# Altium schematic sheet LED_String_AREM-80C0.SchDoc: STB Light Board - 850nm String
size A4; Author: flmoll; DrawnBy: flmoll; Organization: PBL; Revision: A; SheetNumber: 14; SheetTotal: 20
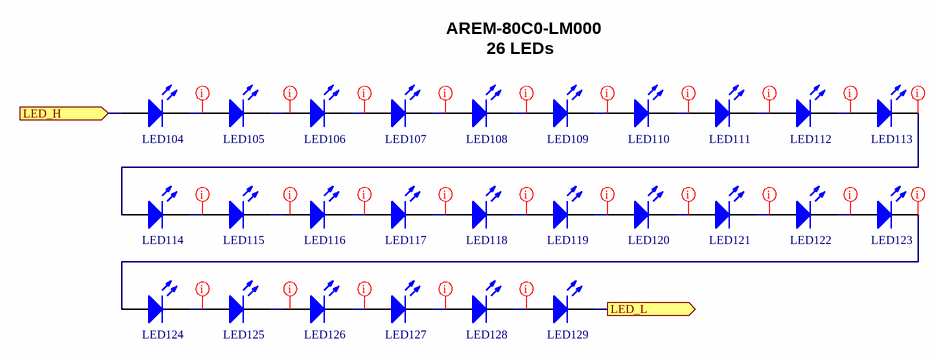
[diagram p0: LED_String_AREM-80C0.SchDoc]

## Parts
LED104  AREM-80C0-LM000  [AREM-80C0-LM000]  (value not drawn)
LED105  AREM-80C0-LM000  [AREM-80C0-LM000]  (value not drawn)
LED106  AREM-80C0-LM000  [AREM-80C0-LM000]  (value not drawn)
LED107  AREM-80C0-LM000  [AREM-80C0-LM000]  (value not drawn)
LED108  AREM-80C0-LM000  [AREM-80C0-LM000]  (value not drawn)
LED109  AREM-80C0-LM000  [AREM-80C0-LM000]  (value not drawn)
LED110  AREM-80C0-LM000  [AREM-80C0-LM000]  (value not drawn)
LED111  AREM-80C0-LM000  [AREM-80C0-LM000]  (value not drawn)
LED112  AREM-80C0-LM000  [AREM-80C0-LM000]  (value not drawn)
LED113  AREM-80C0-LM000  [AREM-80C0-LM000]  (value not drawn)
LED114  AREM-80C0-LM000  [AREM-80C0-LM000]  (value not drawn)
LED115  AREM-80C0-LM000  [AREM-80C0-LM000]  (value not drawn)
LED116  AREM-80C0-LM000  [AREM-80C0-LM000]  (value not drawn)
LED117  AREM-80C0-LM000  [AREM-80C0-LM000]  (value not drawn)
LED118  AREM-80C0-LM000  [AREM-80C0-LM000]  (value not drawn)
LED119  AREM-80C0-LM000  [AREM-80C0-LM000]  (value not drawn)
LED120  AREM-80C0-LM000  [AREM-80C0-LM000]  (value not drawn)
LED121  AREM-80C0-LM000  [AREM-80C0-LM000]  (value not drawn)
LED122  AREM-80C0-LM000  [AREM-80C0-LM000]  (value not drawn)
LED123  AREM-80C0-LM000  [AREM-80C0-LM000]  (value not drawn)
LED124  AREM-80C0-LM000  [AREM-80C0-LM000]  (value not drawn)
LED125  AREM-80C0-LM000  [AREM-80C0-LM000]  (value not drawn)
LED126  AREM-80C0-LM000  [AREM-80C0-LM000]  (value not drawn)
LED127  AREM-80C0-LM000  [AREM-80C0-LM000]  (value not drawn)
LED128  AREM-80C0-LM000  [AREM-80C0-LM000]  (value not drawn)
LED129  AREM-80C0-LM000  [AREM-80C0-LM000]  (value not drawn)

## Ports
LED_H (in, see LED_Driver_AREM-80C0[2B]), LED_L (out, see LED_Driver_AREM-80C0[2B])

## Nets
LED_H: LED104.2(A) ; port LED_H
LED_L: LED129.1(K) ; port LED_L
NetLED104_1: LED104.1(K) LED105.2(A)
NetLED105_1: LED105.1(K) LED106.2(A)
NetLED106_1: LED106.1(K) LED107.2(A)
NetLED107_1: LED107.1(K) LED108.2(A)
NetLED108_1: LED108.1(K) LED109.2(A)
NetLED109_1: LED109.1(K) LED110.2(A)
NetLED110_1: LED110.1(K) LED111.2(A)
NetLED111_1: LED111.1(K) LED112.2(A)
NetLED112_1: LED112.1(K) LED113.2(A)
NetLED113_1: LED113.1(K) LED114.2(A)
NetLED114_1: LED114.1(K) LED115.2(A)
NetLED115_1: LED115.1(K) LED116.2(A)
NetLED116_1: LED116.1(K) LED117.2(A)
NetLED117_1: LED117.1(K) LED118.2(A)
NetLED118_1: LED118.1(K) LED119.2(A)
NetLED119_1: LED119.1(K) LED120.2(A)
NetLED120_1: LED120.1(K) LED121.2(A)
NetLED121_1: LED121.1(K) LED122.2(A)
NetLED122_1: LED122.1(K) LED123.2(A)
NetLED123_1: LED123.1(K) LED124.2(A)
NetLED124_1: LED124.1(K) LED125.2(A)
NetLED125_1: LED125.1(K) LED126.2(A)
NetLED126_1: LED126.1(K) LED127.2(A)
NetLED127_1: LED127.1(K) LED128.2(A)
NetLED128_1: LED128.1(K) LED129.2(A)

## Layout directives
net class LED: (no net found under the mark), NetLED104_1, NetLED106_1, NetLED107_1, NetLED108_1, NetLED109_1, NetLED110_1, NetLED111_1, NetLED112_1, NetLED113_1, NetLED114_1, NetLED116_1, NetLED117_1, NetLED118_1, NetLED119_1, NetLED120_1, NetLED121_1, NetLED122_1, NetLED123_1, NetLED124_1, NetLED126_1, NetLED127_1, NetLED128_1

## Notes on the sheet
- AREM-80C0-LM000
- 26 LEDs
- 1
- 2
- 3
- 4
- A
- B
- C
- Project:
- D
- Date:
- Drawing number:
- Rev:
- Format:
- A4 Q
- Drawn by:
- Laboratory:
- Page
- Sheet:
- of
- File:

## Library data of the parts
LED104-LED129 = CMP-02056-1: Infrared (IR) Emitter 850nm 1.5V 70mA 14.4mW/sr @ 70mA (Typ) 120° 2-PLCC; Mfr: Broadcom Limited; Manufacturer: Broadcom; Base Product Number: AREM; Series: AREM-80C0-xx000; Type: Infrared (IR); Current - DC Forward (If) (Max): 70mA; Radiant Intensity (Ie) Min @ If: 14.4mW/sr @ 70mA (Typ); Wavelength: 850nm; Voltage - Forward (Vf) (Typ): 1.5V; Viewing Angle: 120°; Orientation: Top View; Operating Temperature: -40°C ~ 100°C; Mounting Type: Surface Mount; Package / Case: 2-PLCC; Supplier 1: Digi-Key; Supplier Part Number 1: 516-AREM-80C0-LM000DKR-ND; Manufacturer Part Number: AREM-80C0-LM000; RoHS: No; Stock 1: 49823; Pricing 1: 1=0.62000, 10=0.40500, 100=0.26800, 1000=0.20689 (USD)